# EAGLE design OSO-RING-A1-01 (EAGLE 9.6.2)
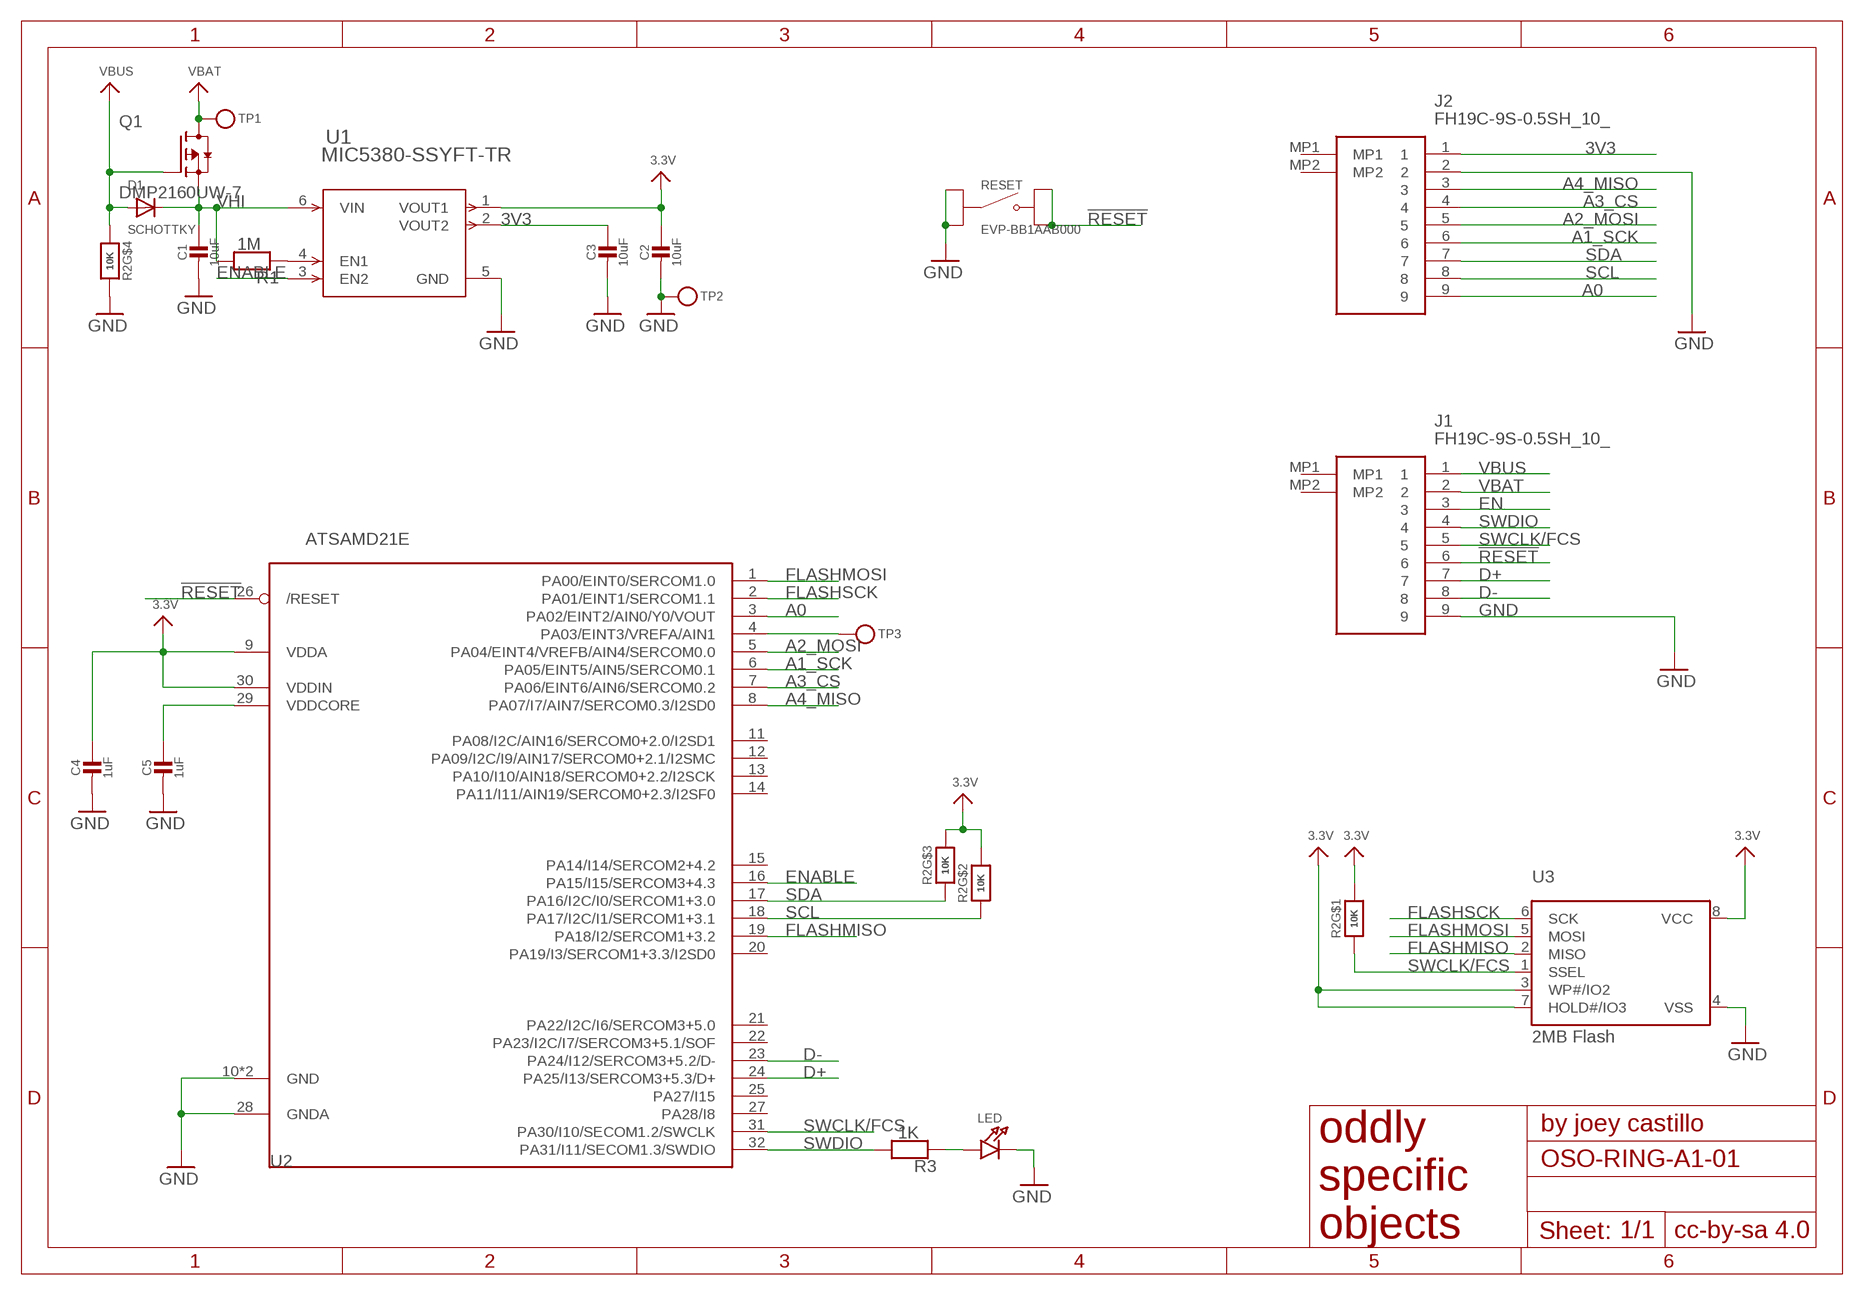
[diagram p0: schematic, sheet 1]

## Parts
C1  10uF  CAP_CERAMIC_0603MP  [_0603MP]
C2  10uF  CAP_CERAMIC_0603MP  [_0603MP]
C3  10uF  CAP_CERAMIC_0603MP  [_0603MP]
C4  1uF  CAP_CERAMIC_0603MP  [_0603MP]
C5  1uF  CAP_CERAMIC_0603MP  [_0603MP]
D1  SCHOTTKY  DIODESOD-323F  [SOD-323F]
J1  FH19C-9S-0.5SH_10_  [FH19C9S05SH10]
J2  FH19C-9S-0.5SH_10_  [FH19C9S05SH10]
LED  LED0603_NOOUTLINE  [CHIPLED_0603_NOOUTLINE]
Q1  DMP2160UW-7  [SOT65P210X110-3N]
R1  1M  RESISTOR_0603MP  [_0603MP]
R2  10K  EXB-V8V103JV-GOOD  [EXBV8V]
R3  1K  RESISTOR_0603MP  [_0603MP]
RESET  EVP-BB1AAB000  [SW_EVP-BB1AAB000]
TP1  TESTPOINTPAD2MM  [TESTPOINT_PAD_2MM]
TP2  TESTPOINTPAD2MM  [TESTPOINT_PAD_2MM]
TP3  TESTPOINTPAD1MM  [TESTPOINT_PAD_1MM]
U1  MIC5380-SSYFT-TR  [TMLF-6_FT_MCH]
U2  ATSAMD21E  [QFN32_5MM]
U3  2MB Flash  SPIFLASH_8PINUX  [USON8]

## Nets
3.3V [power]: C2.1 C4.1 R2.6 R2.7 R2.8 U1.1(VOUT1) U2.9(VDDA) U2.30(VDDIN) U3.3(WP#/IO2) U3.7(HOLD#/IO3) U3.8(VCC)
3V3 [power]: C3.1 J2.1 U1.2(VOUT2)
!RESET: J1.6 RESET.B1 RESET.B2 U2.26(/RESET)
A0: J2.9 U2.3(PA02/EINT2/AIN0/Y0/VOUT)
A1_SCK: J2.6 U2.6(PA05/EINT5/AIN5/SERCOM0.1)
A2_MOSI: J2.5 U2.5(PA04/EINT4/VREFB/AIN4/SERCOM0.0)
A3_CS: J2.4 U2.7(PA06/EINT6/AIN6/SERCOM0.2)
A4_MISO: J2.3 U2.8(PA07/I7/AIN7/SERCOM0.3/I2SD0)
D+: J1.7 U2.24(PA25/I13/SERCOM3+5.3/D+)
D-: J1.8 U2.23(PA24/I12/SERCOM3+5.2/D-)
EN: J1.3 R1.1 U1.4(EN1)
ENABLE: U1.3(EN2) U2.16(PA15/I15/SERCOM3+4.3)
FLASHMISO: U2.19(PA18/I2/SERCOM1+3.2) U3.2(MISO)
FLASHMOSI: U2.1(PA00/EINT0/SERCOM1.0) U3.5(MOSI)
FLASHSCK: U2.2(PA01/EINT1/SERCOM1.1) U3.6(SCK)
FREE_PIN!: TP3.P$1 U2.4(PA03/EINT3/VREFA/AIN1)
GND [gnd]: C1.2 C2.2 C3.2 C4.2 C5.2 J1.9 J2.2 LED.C R2.5 RESET.A1 RESET.A2 TP2.P$1 U1.5(GND) U2.10(GND) U2.28(GNDA) U2.33(GND) U3.4(VSS)
N$1: LED.A R3.1
SCL: J2.8 R2.2 U2.18(PA17/I2C/I1/SERCOM1+3.1)
SDA: J2.7 R2.3 U2.17(PA16/I2C/I0/SERCOM1+3.0)
SWCLK/FCS: J1.5 R2.1 U2.31(PA30/I10/SECOM1.2/SWCLK) U3.1(SSEL)
SWDIO: J1.4 R3.2 U2.32(PA31/I11/SECOM1.3/SWDIO)
VBAT [power]: J1.2 Q1.3(D) TP1.P$1
VBUS [power]: D1.A J1.1 Q1.1(G) R2.4
VDDCORE [power]: C5.1 U2.29(VDDCORE)
VHI [power]: C1.1 D1.C Q1.2(S) R1.2 U1.6(VIN)
Unconnected: J1.MP1 J1.MP2 J2.MP1 J2.MP2 U2.11(PA08/I2C/AIN16/SERCOM0+2.0/I2SD1) U2.12(PA09/I2C/I9/AIN17/SERCOM0+2.1/I2SMC) U2.13(PA10/I10/AIN18/SERCOM0+2.2/I2SCK) U2.14(PA11/I11/AIN19/SERCOM0+2.3/I2SF0) U2.15(PA14/I14/SERCOM2+4.2) U2.20(PA19/I3/SERCOM1+3.3/I2SD0) U2.21(PA22/I2C/I6/SERCOM3+5.0) U2.22(PA23/I2C/I7/SERCOM3+5.1/SOF) U2.25(PA27/I15) U2.27(PA28/I8)

## Library data of the parts
C1-C5 = microbuilder:CAP_CERAMIC: Ceramic Capacitors For new designs, use the packages preceded by an '_' character since they are more reliable: The following footprints should be used on most boards: _0402 - Standard footprint for regular board layouts _0603 - Standard footprint for regular board layouts _0805 - Standard footprint for regular board layouts _1206 - Standard footprint for regular board layouts For extremely tight-pitch boards where space is at a premium, the following 'micro-pitch' footprints can be used (smaller pads, no silkscreen outline, etc.): _0402MP - Micro-pitch footprint for very dense/compact boards _0603MP - Micro-pitch footprint for very dense/compact boards _0805MP - Micro-pitch footprint for very dense/compact boards _1206MP - Micro-pitch footprint for very dense/compact boards
D1 = adafruit:DIODE: Diode SMADIODE - SMA Surface Mount Package 20V 1A Schottky Diode Digikey: 641-1014-6-ND DO-1N4148 - Through Hole Small Current Diode SOD-123 20V 1 A (.5mV Vf) Schottky Diode - Digikey: MBRX120TPMSCT-ND SOD-323 10V 570mA (.38mV Vf, 3ns) Schottky Diode - Digikey: ZLLS410CT-ND SOD-523 30V 30mA Schottky Diode (RB751S-40TE61) - Digikey: RB751S-40TE61CT-ND SOT23-R/W - SOT23 Package (R = Solder Paste/Reflow Ovens, W = Hand-Soldering) BAT54Film 40V 300mA - Digikey: 497-7162-1-ND
J1 J2 = FH19C-9S-0.5SH:FH19C-9S-0.5SH_10_: CONN FFC BOTTOM 9POS 0.50MM R/A Source: Datasheet <https://componentsearchengine.com/Datasheets/1/FH19C-9S-0.5SH(10).pdf>; DESCRIPTION: CONN FFC BOTTOM 9POS 0.50MM R/A; HEIGHT: 1mm; MANUFACTURER_NAME: Hirose; MANUFACTURER_PART_NUMBER: FH19C-9S-0.5SH(10); MOUSER_PART_NUMBER: 798-FH19C9S05SH10; MOUSER_PRICE-STOCK: https://www.mouser.co.uk/ProductDetail/Hirose-Connector/FH19C-9S-05SH10?qs=vnk2wBG9e15bX8eK%2FvDSMA%3D%3D
LED = My Stuff:LED: LED 0603 - 0603 Surface Mount Package 2mA: Green LED - Low Power (3.9mcd, 2ma, 1.7Vf) - Digikey: 475-2709-2-ND Orange LED - Low Power (9.8mcd, 2ma, 1.8Vf) - Digikey: 475-1194-2-ND Red LED - Low Power (5mcd, 2ma, 1.8Vf) - Digikey: 475-1195-2-ND Yellow LED - Low Power (7mcd, 2ma, 1.8Vf) - Digikey: 475-1196-2-ND 5mA: Blue LED - Low Power (17mcd, 5ma, 2.9Vf) - Digikey: LNJ937W8CRACT-ND 0805 - 0805 Surface Mount Package 2mA: Red LED (8.8mcd, 2mA, 1.8Vf, Clear) - Low Power [Digikey: 475-2510-1-ND] Green LED (5mcd, 2mA, 1.8Vf, Clear) - Low Power [Digikey: 475-2730-1-ND] Yellow LED (11.3mcd, 2mA, 1.8Vf, Clear) - Low Power [Digikey: 475-2555-1-ND] 20mA: Red LED (104mcd, 20mA, Diffused) - LS R976 [Digikey: 475-1278-6-ND] Red LED (12mcd, 20mA, 2.0Vf, Clear) - APT2012EC [Digikey: 754-1128-1-ND] Green LED (15mcd, 20mA, 2.2Vf, Clear) - APT2012GC [Digikey: 754-1131-1-ND] Orange LED (160mcd, 20mA, 2.1Vf, Clear) - APT2012SECK [Digikey: 754-1130-1-ND] 1206 - 1206 Surface Mount Package Green LED (26mcd, 20mA, Diffused) - LG N971 [Digikey: 475-1407-6-ND] Red LED (15mcd, 20mA, Diffused) - LH N974 [Digikey: 475-1416-6-ND] Cree - Cree High-Power Surface Mount LEDs XPEBWT-L1-0000-00D50 - White 111lm 350mA 2.9Vf 6200K 110° XTEAWT-00-0000-00000LEE3 - White 114lm 350mA 2.85Vf 5000K 115° Everlight - Everlight 45-21 Series Surface Mount LEDs 45-21/QK2C-B2832AC2CB2/2T - Warm White 2000mcd 20mA 3.25Vf 3050K 120° 45-21/LK2C-B38452C4CB2/2T - Nuetral White 2000mcd 20mA 3.25Vf 4150K 120° 45-21/LK2C-B50634C6CB2/2T - Cold White 2200mcd 20mA 3.25Vf 5650K 120° PLCC2 Reverse Mount LS T77K-J1L2-1-0-2-R18-Z - Red 11.25mcd 2mA 1.8Vf 630nm 120° LO T77K-L1M2-24-Z - Orange 19.6mcd 2mA 1.8Vf 606nm 120° LY T77K-K2M1-26-Z - Yellow 15.7mcd 2mA 1.8Vf 587nm 120°
Q1 = DMP2160UW-7:DMP2160UW-7: DMP2160UW Series 20 V 100 mOhm P-Channel Enhancement Mode Mosfet - SOT-323; DESCRIPTION: P-Channel 20V 1.5A (Ta) 350mW (Ta) Surface Mount SOT-323; DIGI-KEY_PART_NUMBER: DMP2160UWDICT-ND; MF: Diodes Inc.; MP: DMP2160UW-7; PACKAGE: SOT-323 Diodes Inc.
R1 R3 = microbuilder:RESISTOR: Resistors For new designs, use the packages preceded by an '_' character since they are more reliable: The following footprints should be used on most boards: _0402 - Standard footprint for regular board layouts _0603 - Standard footprint for regular board layouts _0805 - Standard footprint for regular board layouts _1206 - Standard footprint for regular board layouts For extremely tight-pitch boards where space is at a premium, the following 'micro-pitch' footprints can be used (smaller pads, no silkscreen outline, etc.): _0402MP - Micro-pitch footprint for very dense/compact boards _0603MP - Micro-pitch footprint for very dense/compact boards _0805MP - Micro-pitch footprint for very dense/compact boards _1206MP - Micro-pitch footprint for very dense/compact boards
R2 = resistor array:EXB-V8V103JV-GOOD; MANUFACTURER_PART_NUMBER: EXBV8V103JV; VENDOR: Panasonic
RESET = EVP-BB1AAB000:EVP-BB1AAB000: SWITCH TACTILE SPST-NO 0.02A 15V; DESCRIPTION: Tactile Switch SPST-NO Top Actuated Surface Mount; DIGI-KEY_PART_NUMBER: P124390CT-ND; MF: Panasonic Electronic Components; MP: EVP-BB1AAB000; PACKAGE: None; PURCHASE-URL: https://pricing.snapeda.com/search/part/EVP-BB1AAB000/?ref=eda
TP1-TP3 = pygamer-microbuilder:TESTPOINT: Test Point Various test points for characterisation and PCB testing TESTPOINT_SMT - Compact Surface Mount Test Point [Digikey: 5016KTR-ND]
U1 = MIC5380SSYFTTR:MIC5380-SSYFT-TR; BUILT_BY: EMA_Jessica; COPYRIGHT: Copyright (C) 2018 Accelerated Designs. All rights reserved; MANUFACTURER_PART_NUMBER: MIC5380-SSYFT-TR; SOURCELIBRARY: Microchip_2019-08-23_3; VENDOR: Microchip
U2 = microbuilder:ATSAMD21E
U3 = microbuilder:SPIFLASH_8PIN: SOIC8 SPI Flash Be careful with the size since SOIC8 flash comes in several 'widths' SOIC8 150 mil M25P16 - 16Mbit (2Mbit x 8) Serial Flash (75MHz SPI Bus), Supply: 2.7-3.6V Digikey: SOIC8 - M25P16-VMN6P-ND SOIC8 208 mil W25Q16BVSSIG - 16Mbit (2Mbit x 8) Serial Flash (104MHz SPI Bus), Supply: 2.7-3.6V Digikey: SOIC8 - W25Q16BVSSIG-ND

## Net classes
0 default: width 0.102 mm
1 power: width 0.203 mm
2 gnd: width 0.203 mm

## Board
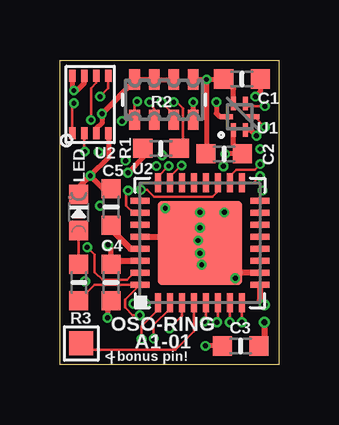
[diagram p1: board, top side]
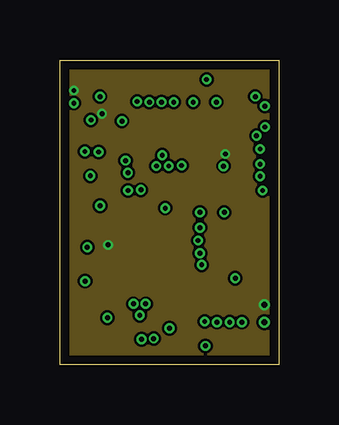
[diagram p2: board, inner layer Route2]
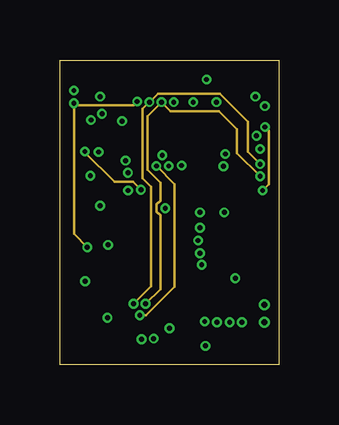
[diagram p3: board, inner layer Route3]
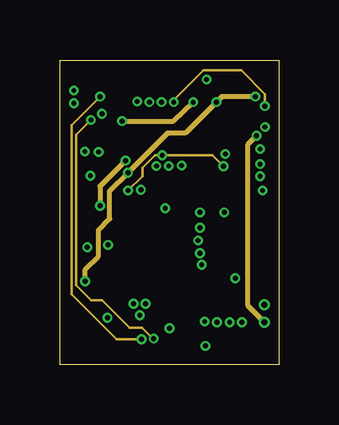
[diagram p4: board, inner layer Route14]
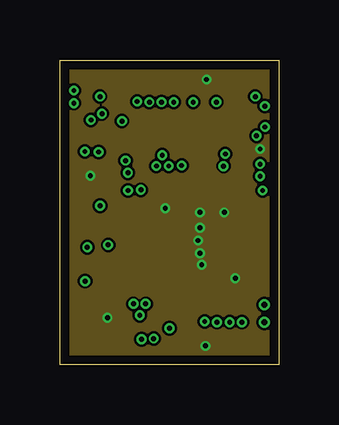
[diagram p5: board, inner layer Route15]
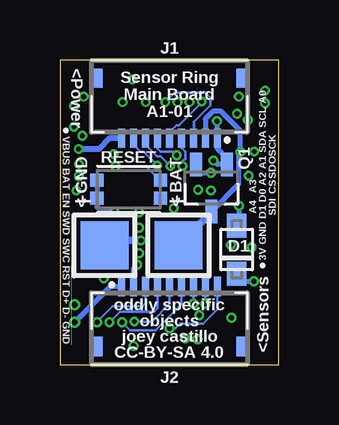
[diagram p6: board, bottom side, seen from below]

Size 9.14 x 12.7 mm. Coordinates in mm from the lower left corner, seen from the top.
Outline: 9.14,12.7 9.14,0 0,0 0,12.7 9.14,12.7
Copper layers (1+2*3+14*15+16): Top 0.04571875mm / dielectric 0.11074375mm / Route2 0.015240625mm / dielectric 4mil / Route3 0.015240625mm / dielectric 0.696975mm / Route14 0.015240625mm / dielectric 4mil / Route15 0.015240625mm / dielectric 0.11074375mm / Bottom 0.04571875mm
Design rules "oshpark-6layer-tentative": minimum track width 4mil, minimum drill 8mil, track to track 4mil, track to pad 4mil, pad to pad 4mil, via to via 4mil, smd to smd 4mil, copper to edge 15mil, drill to drill 6mil, minimum pad ring 4mil, minimum via ring 4mil, stop-mask expansion 1.5mil, vias tented up to drill 10mil, thermal gap 10mil

### Footprints (pad centres in the part's own frame; a part is rotated, then mirrored left to right if it is on the bottom)
_0603MP = smd 0.8 x 0.8: 1 -0.762,0; 2 0.762,0
SOD-323F = smd 1 x 0.8: A -1,0; C 1,0
FH19C9S05SH10 = smd 0.3 x 0.8: 1 -2,2.5; 2 -1.5,2.5; 3 -1,2.5; 4 -0.5,2.5; 5 0,2.5; 6 0.5,2.5; 7 1,2.5; 8 1.5,2.5; 9 2,2.5 | smd 0.4 x 0.8: MP1 -3,0; MP2 3,0
CHIPLED_0603_NOOUTLINE = smd 0.8 x 0.8: A 0,-0.75; C 0,0.75
SOT65P210X110-3N = smd 0.97 x 0.5: 1 -0.98,0.65; 2 -0.98,-0.65; 3 0.98,0
EXBV8V = smd 0.838 x 0.457: 1 -0.838,1.219; 2 -0.838,0.406; 3 -0.838,-0.406; 4 -0.838,-1.219; 5 0.838,-1.219; 6 0.838,-0.406; 7 0.838,0.406; 8 0.838,1.219
SW_EVP-BB1AAB000 = smd 0.55 x 0.55: A1 -1.325,0.375; A2 -1.325,-0.375; B1 1.325,0.375; B2 1.325,-0.375
TESTPOINT_PAD_2MM = smd 2 x 2: P$1 0,0
TESTPOINT_PAD_1MM = smd 1 x 1: P$1 0,0
TMLF-6_FT_MCH = smd 0.559 x 0.203: 1 -0.546,0.25; 2 -0.546,-0.25; 4 0.546,-0.25; 5 0.546,0.25 | smd 0.203 x 0.559: 3 0,-0.546; 6 0,0.546
QFN32_5MM = smd 0.8 x 0.25: 1 -2.5,1.75; 2 -2.5,1.25; 3 -2.5,0.75; 4 -2.5,0.25; 5 -2.5,-0.25; 6 -2.5,-0.75; 7 -2.5,-1.25; 8 -2.5,-1.75; 17 2.5,-1.75; 18 2.5,-1.25; 19 2.5,-0.75; 20 2.5,-0.25; 21 2.5,0.25; 22 2.5,0.75; 23 2.5,1.25; 24 2.5,1.75 | smd 0.25 x 0.8: 9 -1.75,-2.5; 10 -1.25,-2.5; 11 -0.75,-2.5; 12 -0.25,-2.5; 13 0.25,-2.5; 14 0.75,-2.5; 15 1.25,-2.5; 16 1.75,-2.5; 25 1.75,2.5; 26 1.25,2.5; 27 0.75,2.5; 28 0.25,2.5; 29 -0.25,2.5; 30 -0.75,2.5; 31 -1.25,2.5; 32 -1.75,2.5 | smd 3.5 x 3.5: 33 0,0
USON8 = smd 0.5 x 0.275: 1 -1.2,0.75; 2 -1.2,0.25; 3 -1.2,-0.25; 4 -1.2,-0.75; 5 1.2,-0.75; 6 1.2,-0.25; 7 1.2,0.25; 8 1.2,0.75

### Placement (x,y rotation side)
C1  7.6,11.91 180 top
C2  6.86,8.79 180 top
C3  7.54,0.79 180 top
C4  2.13,3.43 270 top
C5  2.13,6.58 90 top
D1  1.77,4.8 270 bottom
J1  4.57,11.94 180 bottom
J2  4.57,0.76 0 bottom
LED  0.79,6.35 0 top
Q1  2.82,7.37 270 bottom
R1  4.22,9.02 180 top
R2  4.34,11.05 90 top
R3  0.79,3.43 270 top
RESET  6.27,7.32 0 bottom
TP1  4.19,4.98 0 bottom
TP2  7.29,4.98 0 bottom
TP3  0.89,0.89 0 top
U1  7.49,10.34 90 top
U2  5.84,5.08 90 top
U3  1.27,10.85 90 top

### Tracks (layer width: path | path; a pad name or v marks a point on that pad's centre or on a via)
3.3V  (via drill 0.2, 0.25)
  Top 0.203: R2.6 R2.7 R2.8 3.12,11.84 v1.75,10.46 1.75,10.06 1.52,9.83 U3.3 | U3.7 1.02,11.74 0.71,11.43 v0.58,11.43 0.52,11.49 U3.8 | U1.1 7.24,9.16 C2.1 v6.9,8.79 v6.9,8.78 | C4.1 2.13,4.88 v2.01,5
  Top 0.254: U2.9 8.34,2.69 v8.53,2.5 | C4.1 2.27,4.33 U2.30
  pour Route2: 0,12.7 9.14,12.7 9.14,0 0,0
3V3  (via drill 0.2, 0.25)
  Top 0.203: U1.2 7.96,9.79 v8.2,9.54
  Top 0.254: v8.53,1.78 8.53,1.02 C3.1
  Route14 0.203: v8.2,9.54 7.82,9.17 7.82,2.49 v8.53,1.78
  Bottom 0.203: J2.1 7.05,3.26 v8.53,1.78
!RESET  (via drill 0.2)
  Top 0.102: U2.26 3.07,6.33 2.76,6.63 2.76,7.18 v2.84,7.26
  Route14 0.102: v2.84,7.26 3.44,7.86 3.44,8.21 3.97,8.73 v4.27,8.73 6.37,8.73 v6.83,8.28
  Bottom 0.102: v4.27,8.73 4.42,8.89 4.95,8.89 5.07,9.01 J1.6 | v6.83,8.28 5.56,8.28 4.97,7.69 RESET.B1 RESET.B2
A0  (via drill 0.2)
  Top 0.102: U2.3 5.09,2.04 v4.57,1.52
  Bottom 0.102: J2.9 2.57,2.3 3.17,1.7 4.14,1.7 4.32,1.52 v4.57,1.52
A1_SCK  (via drill 0.2)
  Top 0.102: U2.6 6.59,1.82 v6.55,1.78
  Bottom 0.102: J2.6 4.07,2.53 5.16,1.45 6.22,1.45 v6.55,1.78
A2_MOSI  (via drill 0.2)
  Top 0.102: U2.5 6.09,1.85 v6.05,1.8 v6.04,1.8
  Bottom 0.102: J2.5 4.57,2.54 5.31,1.8 v6.04,1.8
A3_CS  (via drill 0.2)
  Top 0.102: U2.7 v7.09,1.79 v7.08,1.78
  Bottom 0.102: v7.08,1.78 v7.07,1.78 6.64,2.21 5.22,2.21 5.07,2.36 J2.4
A4_MISO  (via drill 0.2)
  Top 0.102: U2.8 v7.59,1.78
  Bottom 0.102: v7.59,1.78 7.59,1.79 6.95,2.44 5.69,2.44 5.57,2.56 J2.3
D+  (via drill 0.2)
  Top 0.102: U2.24 4.09,7.84 v4.54,8.29
  Bottom 0.102: v4.54,8.29 4.94,8.68 5.08,8.68 5.57,9.17 J1.7
D-  (via drill 0.2)
  Top 0.102: v5.08,8.31 5.06,8.31 4.59,7.83 U2.23
  Bottom 0.102: v5.08,8.31 5.66,8.89 5.79,8.89 6.07,9.17 J1.8
EN  (via drill 0.2)
  Top 0.102: U1.4 7.85,10.78 v8.55,10.78 | v4.75,10.95 4.88,10.95 5.13,10.69 5.13,9.17 R1.1
  Route14 0.102: v8.55,10.78 v8.56,10.79 8.56,11.27 7.56,12.27 5.99,12.27 4.75,11.02 v4.75,10.95
  Bottom 0.102: J1.3 3.56,9.45 3.56,10.13 2.87,10.82 2.87,11.12 3.07,11.33 4.37,11.33 v4.75,10.95
ENABLE  (via drill 0.2)
  Top 0.102: U2.16 8.34,7.15 v8.46,7.26 | U1.3 8.13,10.34 v8.56,9.91
  Route3 0.102: v8.46,7.26 8.71,7.52 8.71,9.75 v8.56,9.91
FLASHMISO  (via drill 0.2)
  Top 0.102: U2.19 6.59,7.23 6.36,7 3.92,7 3.63,7.29 v3.38,7.29 | v1.04,8.89 1.02,8.91 U3.2
  Route3 0.102: v3.38,7.29 3.05,7.62 2.29,7.62 1.04,8.87 v1.04,8.89
FLASHMOSI  (via drill 0.2)
  Top 0.102: U2.1 4.09,2.3 3.41,1.61 v3.41,1.07 | v1.67,11.18 2.02,11.52 U3.5
  Route14 0.102: v3.41,1.07 2.36,1.07 0.48,2.95 0.48,9.99 v1.67,11.18
FLASHSCK  (via drill 0.2)
  Top 0.102: U2.2 4.59,2.34 3.91,1.66 v3.91,1.09 | U3.6 1.52,11.75 1.29,11.53 v1.29,10.2
  Route14 0.102: v3.91,1.09 3.89,1.09 3.43,1.55 2.9,1.55 1.75,2.69 1.3,2.69 0.69,3.31 0.69,9.59 v1.29,10.2
FREE_PIN!
  Top 0.102: TP3.P$1 0.89,0.63 4.83,0.63 5.59,1.4 U2.4
GND  (via drill 0.2)
  Top 0.203: U1.5 7.24,11.5 C1.2 6.82,11.89 v6.12,11.89 | LED.C 0.79,7.39 v1.27,7.87 | C5.2 1.8,7.34 v1.27,7.87 | v6.12,11.89 R2.5 | C4.2 1.98,2.52 v1.98,1.96 | v5.77,5.18 5.84,5.1 U2.33 4.7,5.08 4.57,5.21 | C3.2 v6.07,0.79 | v6.12,11.89 6.12,8.81 C2.2 | U3.4 2.02,8.62 v1.27,7.87
  Top 0.254: U2.28 4.45,5.33 4.57,5.21 | U2.10 6.25,3.83 v5.92,4.17
  Bottom 0.203: J2.2 6.07,4.01 v5.92,4.17 | v6.86,6.35 7.36,6.35 7.6,6.58 RESET.A2 RESET.A1
  Bottom 0.254: J1.9 7.07,9.44 7.52,8.99 v8.36,8.99
  Bottom 0.305: TP2.P$1 7.09,5.18 v5.77,5.18
  other vias: 5.84,6.35 4.39,6.53 7.32,3.61 5.84,5.71 5.84,4.65
  pour Route15: 0,12.7 9.14,12.7 9.14,0 0,0
N$1
  Top 0.102: LED.A R3.1
SCL  (via drill 0.2)
  Top 0.102: R2.2 3.94,10.67 3.73,10.87 v3.73,10.95 | U2.18 7.09,7.85 7.37,8.13 8.13,8.13 v8.36,8.36
  Route3 0.102: v8.36,8.36 7.85,8.87 7.85,10.13 6.68,11.3 4.09,11.3 v3.73,10.95 3.45,10.66 3.45,7.77 3.81,7.41 3.81,3.28 v3.07,2.54
  Bottom 0.102: J2.8 3.07,2.66 3.07,2.65 v3.07,2.54
SDA  (via drill 0.2)
  Top 0.102: R2.3 4.75,10.44 v4.24,10.95 | U2.17 8.08,7.58 v8.36,7.85
  Route3 0.102: v8.36,7.85 7.39,8.82 7.39,9.8 6.63,10.57 4.62,10.57 v4.24,10.95 3.65,10.36 3.65,8.13 4.19,7.59 4.19,6.83 4.04,6.68 4.04,6.38 4.19,6.22 4.19,3.15 v3.58,2.54
  Bottom 0.102: J2.7 3.57,2.66 3.58,2.65 v3.58,2.54
SWCLK/FCS  (via drill 0.2)
  Top 0.102: U2.31 3.09,3.83 2.8,3.54 1.77,3.54 1.45,3.85 1.45,4.58 v1.14,4.9 | U3.1 0.52,10.84 v0.58,10.9 | v3.23,10.97 3.12,10.87 R2.1
  Route3 0.102: v1.14,4.9 0.58,5.46 v0.58,10.9 0.67,10.82 3.07,10.82 v3.23,10.97
  Bottom 0.102: J1.5 4.57,9.7 4.29,9.99 4.18,9.99 3.23,10.95 v3.23,10.97
SWDIO  (via drill 0.2)
  Top 0.102: R3.2 1.45,3.33 U2.32 2.71,2.7 2.71,2.39 3.04,2.06 v3.33,2.06
  Route3 0.102: v3.33,2.06 3.6,2.06 4.79,3.25 4.79,7.52 v4.02,8.29
  Bottom 0.102: J1.4 4.07,9.04 3.91,8.88 3.91,8.59 4.02,8.48 v4.02,8.29
VBAT  (via drill 0.2)
  Bottom 0.203: Q1.3 1.69,7.51 1.69,8.79 v1.62,8.87 1.62,9.75 2.42,10.56 2.76,10.56 3.07,10.25 J1.2
  Bottom 0.305: Q1.3 2.82,6.36 TP1.P$1
VBUS  (via drill 0.2)
  Top 0.203: R2.4 v5.56,10.95
  Route14 0.203: v2.74,8.51 1.68,7.45 v1.68,6.63 | v2.59,10.15 4.74,10.15 v5.56,10.95
  Bottom 0.203: v2.74,8.51 2.58,8.35 Q1.1 2.17,8.6 2.57,9 J1.1 2.57,10.13 v2.59,10.15 | v1.68,6.63 1.68,5.89 D1.A
VDDCORE
  Top 0.254: U2.29 2.95,4.83 2.13,5.64 C5.1
VHI  (via drill 0.2)
  Top 0.203: v6.53,10.95 6.53,10.48 6.67,10.34 U1.6 | C1.1 8.36,11.38 v8.15,11.18 | R1.2 3.45,8.62 v2.84,8
  Route14 0.203: v1.05,3.49 1.05,3.98 1.61,4.53 1.61,5.6 2.08,6.08 2.08,7.24 v2.84,8 4.49,9.65 5.23,9.65 v6.53,10.95 6.76,11.18 v8.15,11.18
  Bottom 0.203: Q1.2 3.47,8.2 3.27,8 v2.84,8 | D1.C 1.45,3.49 v1.05,3.49

### Text on the board
tPlace: OSO-RING / A1-01 | < bonus pin\! | - | |
bPlace: Sensor Ring / Main Board / A1-01 | <Power | SCK | VBUS BAT EN SWD SWC !RST D+ D- GND | SDO | CS | A3 | - | < BAT | - | < GND | SDI | A4 | | | | | 3V GND D1 D0 A2 A1 SDA SCL A0 | <Sensors | oddly specific / objects / joey castillo / CC-BY-SA 4.0
tNames: U2